# Altium project SMALL_BCMV1.0.PrjPcb (part 2 of 3)

## Sheet Controller.SchDoc
size A2; SheetNumber: 13; SheetTotal: 13
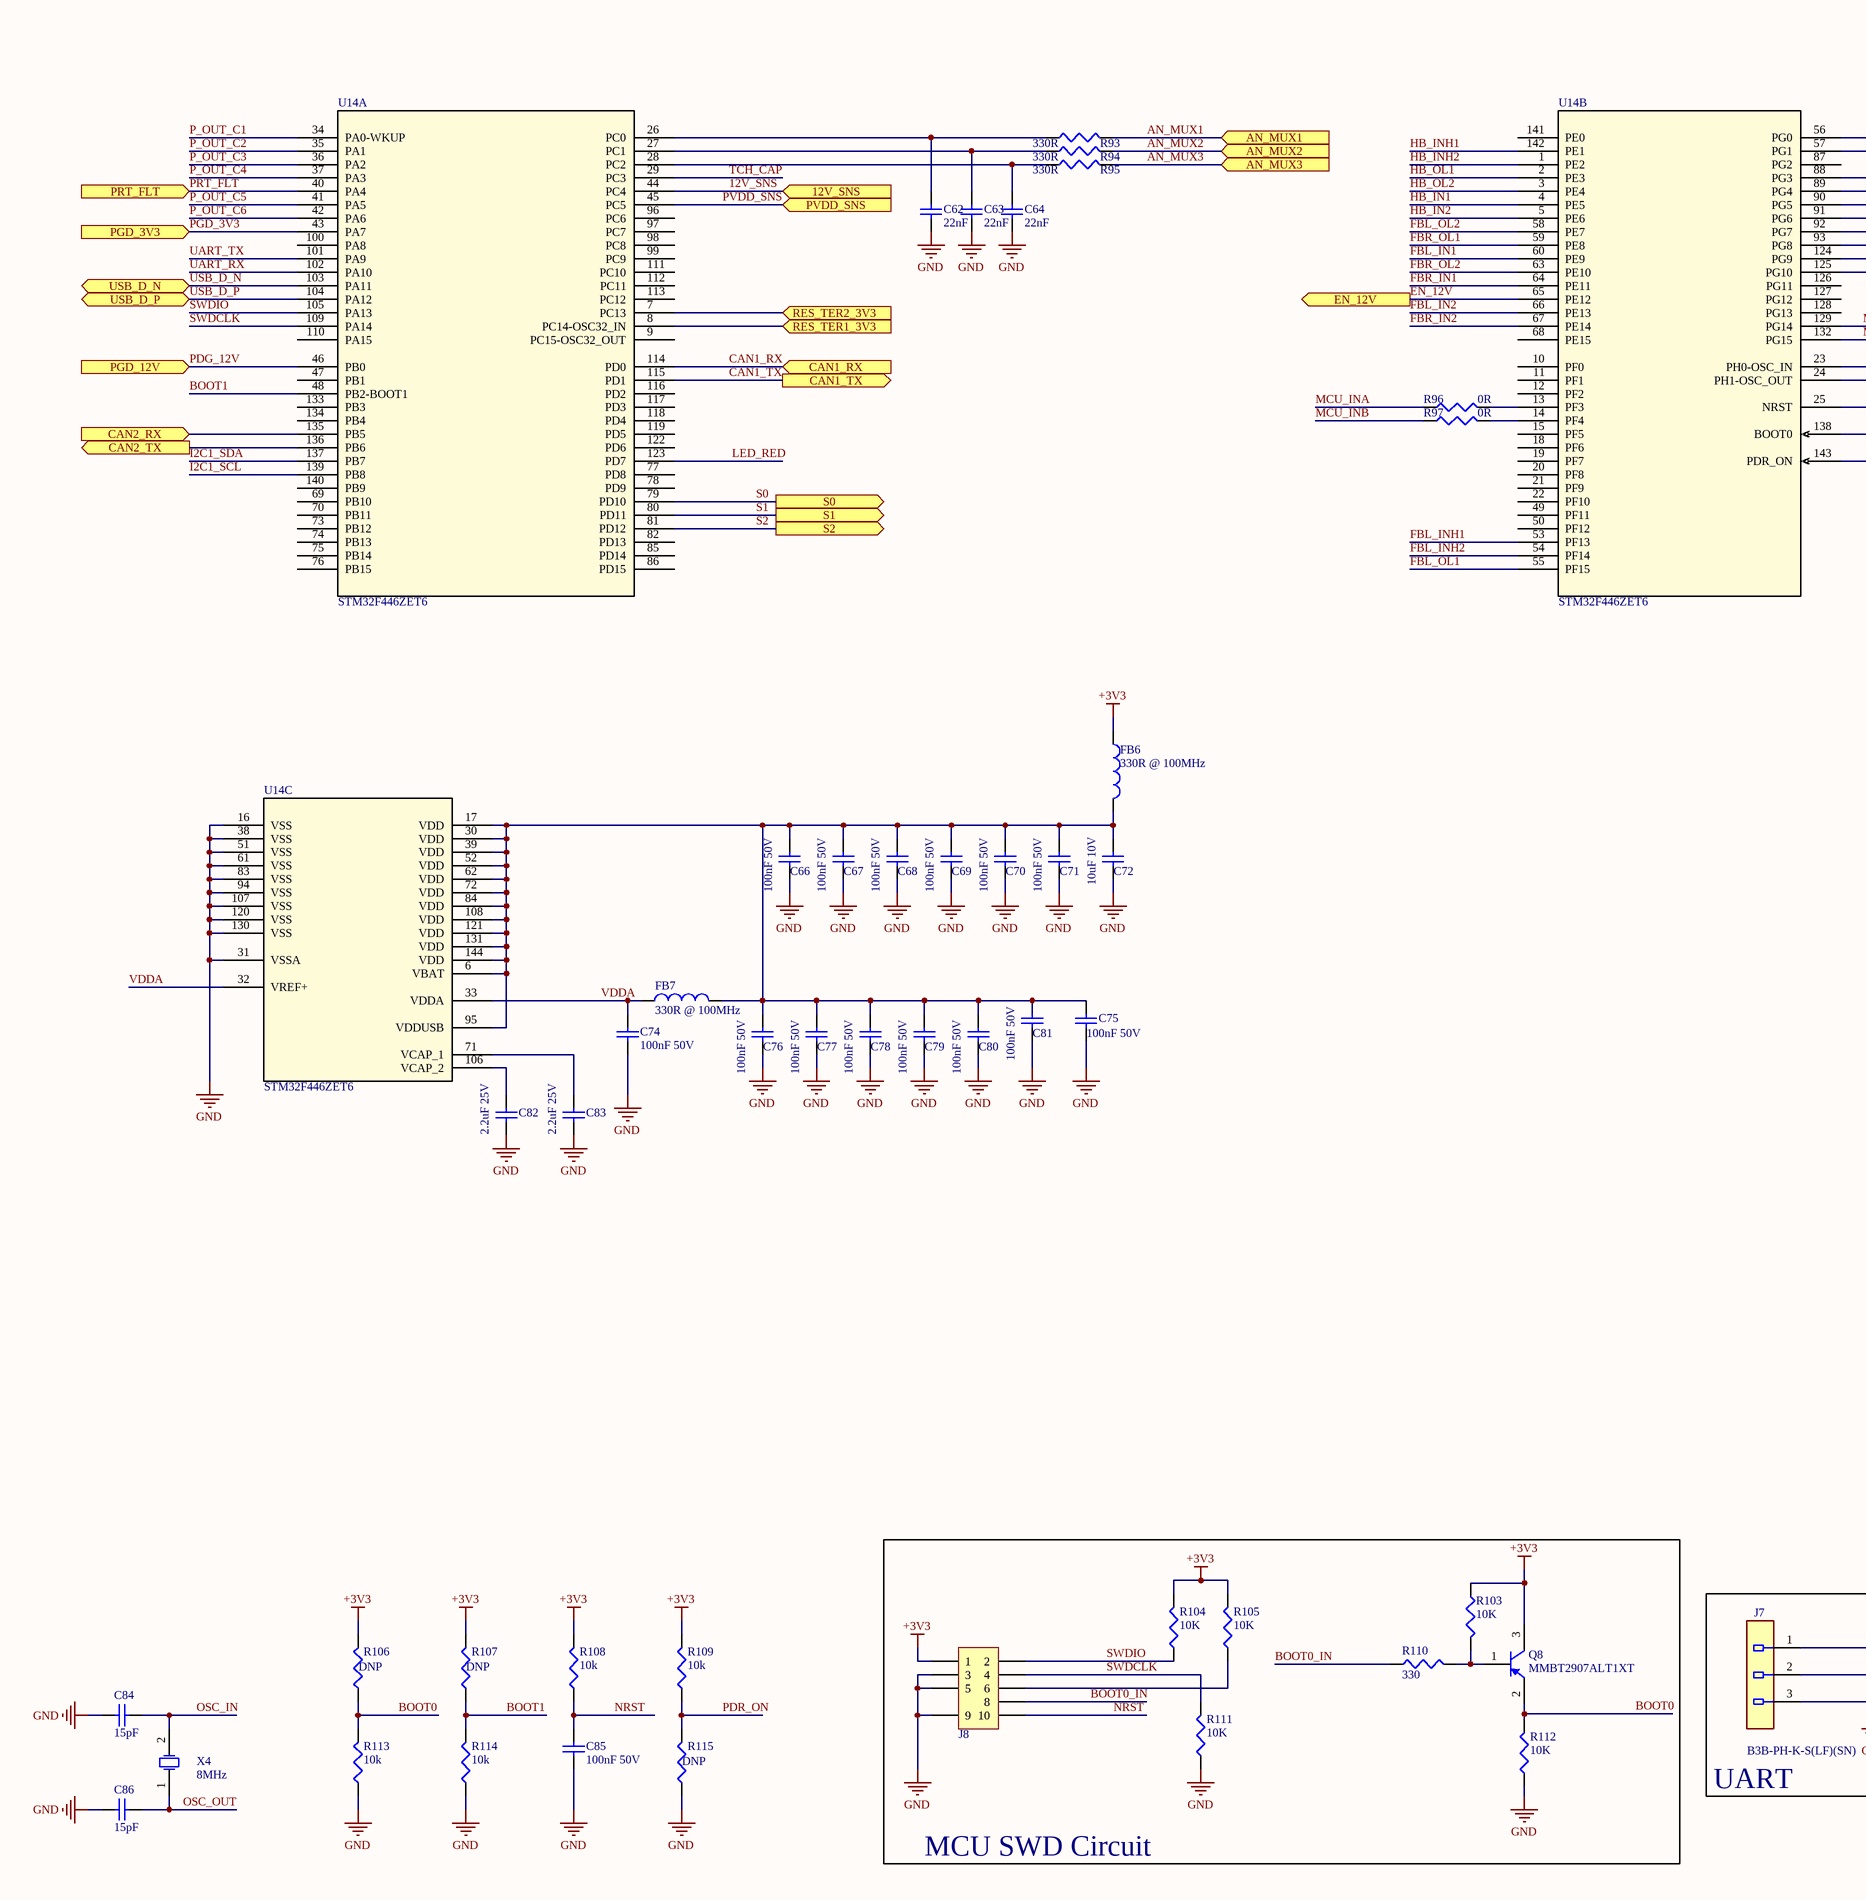
[diagram p12: Controller.SchDoc, left]
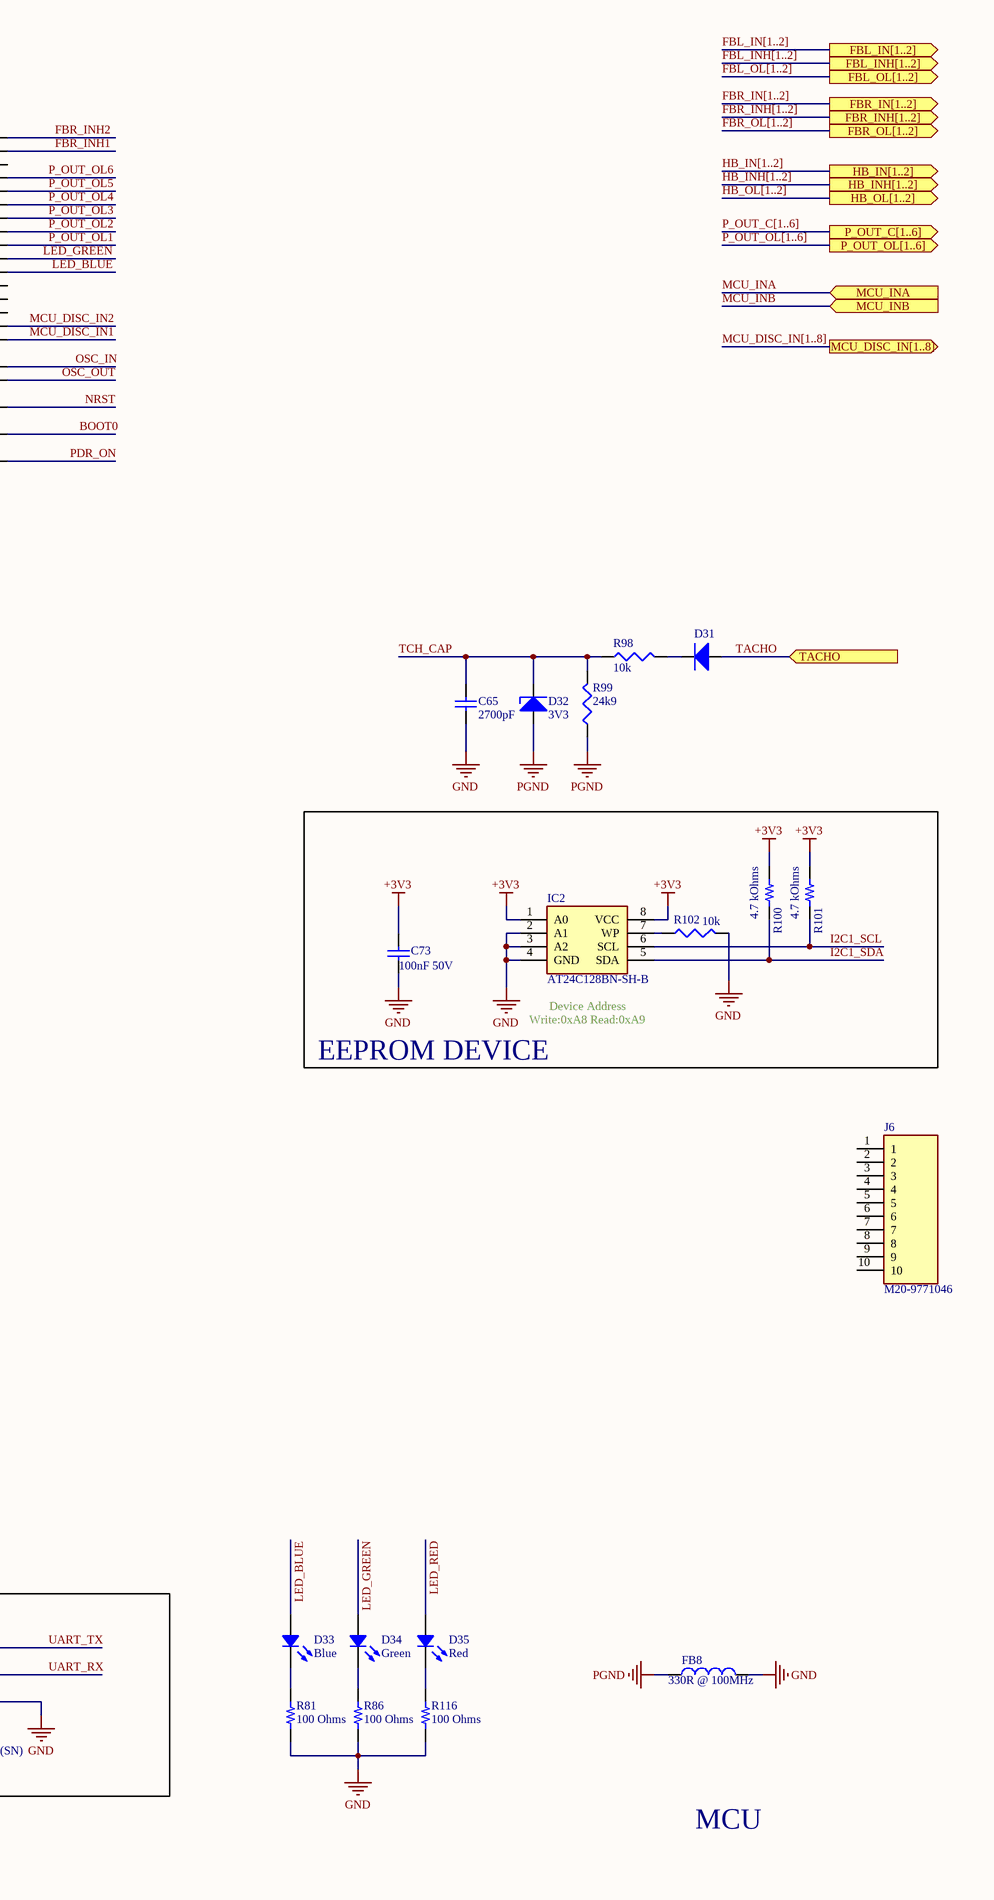
[diagram p13: Controller.SchDoc, right]

### Parts
C62  22nF  [CAP0603]
C63  22nF  [CAP0603]
C64  22nF  [CAP0603]
C65  2700pF  [CAP0603]
C66  100nF 50V  [CAP0603]
C67  100nF 50V  [CAP0603]
C68  100nF 50V  [CAP0603]
C69  100nF 50V  [CAP0603]
C70  100nF 50V  [CAP0603]
C71  100nF 50V  [CAP0603]
C72  10uF 10V  [CAP0805]
C73  100nF 50V  [CAP0603]
C74  100nF 50V  [CAP0603]
C75  100nF 50V  [CAP0603]
C76  100nF 50V  [CAP0603]
C77  100nF 50V  [CAP0603]
C78  100nF 50V  [CAP0603]
C79  100nF 50V  [CAP0603]
C80  100nF 50V  [CAP0603]
C81  100nF 50V  [CAP0603]
C82  2.2uF 25V  [CAP0603]
C83  2.2uF 25V  [CAP0603]
C84  15pF  [CAP0603]
C85  100nF 50V  [CAP0603]
C86  15pF  [CAP0603]
D31  100V 300mA  [SOD123_1N4148W-7-F]  (value not drawn)
D32  3V3  [SOD323]
D33  Blue  [LED 0805_2012 BLUE]
D34  Green  [LED 0805_2012 GREEN]
D35  Red  [LED 0805_2012 RED]
FB6  330R @ 100MHz  [FB0603]
FB7  330R @ 100MHz  [FB0603]
FB8  330R @ 100MHz  [FB0603]
IC2  AT24C128BN-SH-B  [SOIC127P600X175-8N]
J6  M20-9771046  [HDRV10W66P0X254_1X10_2540X254X844P]
J7  B3B-PH-K-S_LF_SN  [JST_B3B-PH-K-S_LF_SN_0]  (value not drawn)
J8  9 pos  [FTSH-105-01-F-DV-007-K-P]  (value not drawn)
Q8  MMBT2907ALT1XT  [SOT95P245X110-3N]
R81  100 Ohms  [RES 0805_2012]
R86  100 Ohms  [RES 0805_2012]
R93  330R  [RES0603]
R94  330R  [RES0603]
R95  330R  [RES0603]
R96  0R  [RES0603]
R97  0R  [RES0603]
R98  10k  [RES0603]
R99  24k9  [RES0603]
R100  4.7 kOhms  [RES 0603_1608]
R101  4.7 kOhms  [RES 0603_1608]
R102  10k  [RES0603]
R103  10K  [R 0603(1608)]
R104  10K  [R 0603(1608)]
R105  10K  [R 0603(1608)]
R106  Assembly: DNP  [RES0603]  (hidden comment: 10k)
R107  Assembly: DNP  [RES0603]  (hidden comment: 10k)
R108  10k  [RES0603]
R109  10k  [RES0603]
R110  330  [R 0603(1608)]
R111  10K  [R 0603(1608)]
R112  10K  [R 0603(1608)]
R113  10k  [RES0603]
R114  10k  [RES0603]
R115  Assembly: DNP  [RES0603]  (hidden comment: 10k)
R116  100 Ohms  [RES 0805_2012]
U14  STM32F446ZET6  [LQFP144-20x20mm]  (parts A,B,C of 3)
X4  8MHz  [CRY_NX8045GB]

### Blocks framed on the sheet
EEPROM DEVICE: C73 IC2 R100-R102
MCU SWD Circuit: J8 Q8 R103-R105 R110-R112
UART: J7

### Ports
12V_SNS (in), AN_MUX1 (in), AN_MUX2 (in), AN_MUX3 (in), CAN1_RX (in), CAN1_TX (out), CAN2_RX (in), CAN2_TX (out), EN_12V (out), FBL_IN[1..2] (out), FBL_INH[1..2] (out), FBL_OL[1..2] (out), FBR_IN[1..2] (out), FBR_INH[1..2] (out), FBR_OL[1..2] (out), HB_IN[1..2] (out), HB_INH[1..2] (out), HB_OL[1..2] (out), MCU_DISC_IN[1..8] (out), MCU_INA (in), MCU_INB (in), P_OUT_C[1..6] (out), P_OUT_OL[1..6] (out), PGD_3V3 (in), PGD_12V (in), PRT_FLT (in), PVDD_SNS (in), RES_TER1_3V3 (in), RES_TER2_3V3 (in), S0 (out), S1 (out), S2 (out), TACHO (in), USB_D_N (bidir), USB_D_P (bidir)

### Nets
+3V3: C73.2 FB6.2 IC2.1(A0) IC2.8(VCC) J8.1 Q8.3(C) R100.2 R101.2 R103.2 R104.1 R105.1 R106.2 R107.2 R108.2 R109.2
GND: C62.2 C63.2 C64.2 C65.1 C66.1 C67.1 C68.1 C69.1 C70.1 C71.1 C72.1 C73.1 C74.1 C75.1 C76.1 C77.1 C78.1 C79.1 C80.1 C81.1 C82.1 C83.1 C84.1 C85.1 C86.1 FB8.2 IC2.2(A1) IC2.3(A2) IC2.4(GND) J7.3 J8.3 J8.5 J8.9 R81.2 R86.2 R102.1 R111.2 R112.1 R113.1 R114.1 R115.1 R116.2 U14.16(VSS) U14.31(VSSA) U14.38(VSS) U14.51(VSS) U14.61(VSS) U14.83(VSS) U14.94(VSS) U14.107(VSS) U14.120(VSS) U14.130(VSS)
PGND: D32.2(A) FB8.1 R99.1
12V_SNS: U14.44(PC4) ; port 12V_SNS
AN_MUX1: R93.2 ; port AN_MUX1
AN_MUX2: R94.2 ; port AN_MUX2
AN_MUX3: R95.2 ; port AN_MUX3
BOOT0: Q8.2(E) R106.1 R112.2 R113.2 U14.138(BOOT0)
BOOT0_IN: J8.8 R110.2
BOOT1: R107.1 R114.2 U14.48(PB2-BOOT1)
CAN1_RX: U14.114(PD0) ; port CAN1_RX
CAN1_TX: U14.115(PD1) ; port CAN1_TX
CAN2_RX: U14.135(PB5) ; port CAN2_RX
CAN2_TX: U14.136(PB6) ; port CAN2_TX
EN_12V: U14.65(PE12) ; port EN_12V
FBL_IN1: U14.60(PE9)
FBL_IN2: U14.66(PE13)
FBL_INH1: U14.53(PF13)
FBL_INH2: U14.54(PF14)
FBL_OL1: U14.55(PF15)
FBL_OL2: U14.58(PE7)
FBR_IN1: U14.64(PE11)
FBR_IN2: U14.67(PE14)
FBR_INH1: U14.57(PG1)
FBR_INH2: U14.56(PG0)
FBR_OL1: U14.59(PE8)
FBR_OL2: U14.63(PE10)
HB_IN1: U14.4(PE5)
HB_IN2: U14.5(PE6)
HB_INH1: U14.142(PE1)
HB_INH2: U14.1(PE2)
HB_OL1: U14.2(PE3)
HB_OL2: U14.3(PE4)
I2C1_SCL: IC2.6(SCL) R101.1 U14.139(PB8)
I2C1_SDA: IC2.5(SDA) R100.1 U14.137(PB7)
LED_BLUE: D33.1 U14.125(PG10)
LED_GREEN: D34.1 U14.124(PG9)
LED_RED: D35.1 U14.123(PD7)
MCU_DISC_IN1: U14.132(PG15)  [project net MCU_D0]
MCU_DISC_IN2: U14.129(PG14)  [project net MCU_D0]
MCU_INA: R96.1 ; port MCU_INA
MCU_INB: R97.1 ; port MCU_INB
NRST: C85.2 J8.10 R108.1 U14.25(NRST)
OSC_IN: C84.2 U14.23(PH0-OSC_IN) X4.2(OSC2)
OSC_OUT: C86.2 U14.24(PH1-OSC_OUT) X4.1(OSC1)
P_OUT_C1: U14.34(PA0-WKUP)
P_OUT_C2: U14.35(PA1)
P_OUT_C3: U14.36(PA2)
P_OUT_C4: U14.37(PA3)
P_OUT_C5: U14.41(PA5)
P_OUT_C6: U14.42(PA6)
P_OUT_OL1: U14.93(PG8)
P_OUT_OL2: U14.92(PG7)
P_OUT_OL3: U14.91(PG6)
P_OUT_OL4: U14.90(PG5)
P_OUT_OL5: U14.89(PG4)
P_OUT_OL6: U14.88(PG3)
PDG_12V: U14.46(PB0) ; port PGD_12V
PDR_ON: R109.1 R115.2 U14.143(PDR_ON)
PGD_3V3: U14.43(PA7) ; port PGD_3V3
PRT_FLT: U14.40(PA4) ; port PRT_FLT
PVDD_SNS: U14.45(PC5) ; port PVDD_SNS
RES_TER1_3V3: U14.8(PC14-OSC32_IN) ; port RES_TER1_3V3
RES_TER2_3V3: U14.7(PC13) ; port RES_TER2_3V3
S0: U14.79(PD10) ; port S0
S1: U14.80(PD11) ; port S1
S2: U14.81(PD12) ; port S2
SWDCLK: J8.4 R111.1 U14.109(PA14)
SWDIO: J8.2 R104.2 U14.105(PA13)
TACHO: D31.1(A) ; port TACHO
TCH_CAP: C65.2 D32.1(K) R98.1 R99.2 U14.29(PC3)
UART_RX: J7.2 U14.102(PA10)
UART_TX: J7.1 U14.101(PA9)
USB_D_N: U14.103(PA11) ; port USB_D_N
USB_D_P: U14.104(PA12) ; port USB_D_P
VDDA: C74.2 FB7.2 U14.32(VREF+) U14.33(VDDA)
NetC62_1: C62.1 R93.1 U14.26(PC0)
NetC63_1: C63.1 R94.1 U14.27(PC1)
NetC64_1: C64.1 R95.1 U14.28(PC2)
NetC66_2: C66.2 C67.2 C68.2 C69.2 C70.2 C71.2 C72.2 C75.2 C76.2 C77.2 C78.2 C79.2 C80.2 C81.2 FB6.1 FB7.1 U14.6(VBAT) U14.17(VDD) U14.30(VDD) U14.39(VDD) U14.52(VDD) U14.62(VDD) U14.72(VDD) U14.84(VDD) U14.95(VDDUSB) U14.108(VDD) U14.121(VDD) U14.131(VDD) U14.144(VDD)
NetC82_2: C82.2 U14.106(VCAP_2)
NetC83_2: C83.2 U14.71(VCAP_1)
NetD31_2: D31.2(K) R98.2
NetD33_2: D33.2 R81.1
NetD34_2: D34.2 R86.1
NetD35_2: D35.2 R116.1
NetIC2_7: IC2.7(WP) R102.2
NetJ8_6: J8.6 R105.2
NetQ8_1: Q8.1(B) R103.1 R110.1
NetR96_2: R96.2 U14.13(PF3)
NetR97_2: R97.2 U14.14(PF4)

Not connected (* = marked no-connect by the designer): J6 1 2 3 4 5 6 7 8 9 10; U14 9(PC15-OSC32_OUT) 10(PF0) 11(PF1) 12(PF2) 15(PF5) 18(PF6) 19(PF7) 20(PF8) 21(PF9) 22(PF10) 47(PB1) 49(PF11) 50(PF12) 68(PE15) 69(PB10) 70(PB11) 73(PB12) 74(PB13) 75(PB14) 76(PB15) 77(PD8) 78(PD9) 82(PD13) 85(PD14) 86(PD15) 87(PG2) 96(PC6) 97(PC7) 98(PC8) 99(PC9) 100(PA8) 110(PA15) 111(PC10) 112(PC11) 113(PC12) 116(PD2) 117(PD3) 118(PD4) 119(PD5) 122(PD6) 126(PG11) 127(PG12) 128(PG13) 133(PB3) 134(PB4) 140(PB9) 141(PE0)

### Buses and harness runs
bus FBL_IN[1..2] = port FBL_IN[1..2]
bus FBL_INH[1..2] = port FBL_INH[1..2]
bus FBL_OL[1..2] = port FBL_OL[1..2]
bus FBR_IN[1..2] = port FBR_IN[1..2]
bus FBR_INH[1..2] = port FBR_INH[1..2]
bus FBR_OL[1..2] = port FBR_OL[1..2]
bus HB_IN[1..2] = port HB_IN[1..2]
bus HB_INH[1..2] = port HB_INH[1..2]
bus HB_OL[1..2] = port HB_OL[1..2]
bus MCU_DISC_IN[1..8] = port MCU_DISC_IN[1..8]
bus P_OUT_C[1..6] = port P_OUT_C[1..6]
bus P_OUT_OL[1..6] = port P_OUT_OL[1..6]

### Notes on the sheet
- Write:0xA8 Read:0xA9
- (near IC2) Device Address
- MCU

### Library data of the parts
C62-C64 = CAP0603_22nF: CAP CER 0.022UF 50V X7R 0603; P/N: CL10B223JB8NNNC; Value: 22nF 50V; Order Code: DIGI : 1276-1996-1-ND
C65 = CAP0603_2700pF: CAP CER 1200PF 50V X7R 0603; P/N: CL10B272KB8NNNC; Value: 2700pF 50V; Order Code: DIGI : 1276-2022-1-ND
C66-C71 C73-C81 C85 = CAP0603_100nF: CAP CER 0.1UF 50V X7R 0603; P/N: C0603C104K5RACTU; Order Code: DIGI : 399-5089-1-ND; Value: 100nF 50V
C72 = CAP0805_10uF: CAP CER 10UF 10V X7R 0805; P/N: GRM21BR71A106MA73L; Order Code: DIGI : 490-10517-1-ND; Value: 10uF 10V
C82 C83 = CAP0603_2.2uF: CAP CER 2.2UF 25V X7S 0603; P/N: GRM188C71E225KE11D; Order Code: DIGI : 490-12732-1-ND; Value: 2.2uF 25V
C84 C86 = CAP0603_15pF: CAP CER 15PF 50V C0G/NP0 0603; P/N: 06035A150JAT4A; Order Code: DIGI : 478-10677-1-ND; Value: 15pF 50V
D31 = DIODE_1N4148W-7-F: DIODE GEN PURP 100V 300MA SOD123; Order Code: DIGI : 1N4148W-FDICT-ND; P/N: 1N4148W-7-F; Value: 100V 300mA
D32 = ZENER_3V3_MM3Z3V3T1G: DIODE ZENER 3.3V 300MW SOD323; Order Code: DIGI : MM3Z3V3T1GOSCT-ND; P/N: MM3Z3V3T1G; Value: 3V3
D33 = IN-S85AT5B: LED BLUE CLEAR 0805 SMD; Manufacturer: Inolux; Configuration: Standard; Current - Test: 5mA; Lens Size: 1.40mm x 1.25mm; Lens Style: Rectangle with Flat Top; Millicandela Rating: 80mcd; Viewing Angle: 120°; Voltage - Forward (Vf) (Typ): 3V; Wavelength - Dominant: 470nm; Wavelength - Peak: 473nm; Part Number: IN-S85AT5B; Color: Blue; ComponentLink1Description: Datasheet; ComponentLink1URL: http://www.inolux-corp.com/datasheet/SMDLED/Mono%20Color%20Top%20View/IN-S85AT%20Series_V1.1.pdf; ComponentLink2Description: DigiKey Link; ComponentLink2URL: https://www.digikey.com/en/products/detail/inolux/IN-S85AT5B/7604912; Device Package: 0805 (2012 Metric); Height (Max): 1.10mm; LastUpdated: 30.06.2022 22:50:57; Lens Color: Clear; Lens Transparency: Clear; Lifecycle Status: Active; Minimum Order: 1; Mounting Type: Surface Mount; Package / Case: 0805 (2012 Metric); Packaging: TapeAndReel; PartId: 751; Part Status: Active; Price: 0.04; Series: IN-S85AT; Size / Dimension: 2.00mm L x 1.25mm W; Supplier 1: DigiKey; Supplier Part Number 1: 1830-1078-1-ND; Supplier Device Package: 0805; Value: Blue
D34 = QTLP630C4TR: LED GREEN CLEAR 0805 SMD; Manufacturer: Everlight Electronics Co Ltd; Configuration: Standard; Current - Test: 20mA; Lens Color: Colorless; Lens Size: 1.40mm x 1.25mm; Lens Style: Rectangle with Flat Top; Millicandela Rating: 10mcd; Viewing Angle: 140°; Voltage - Forward (Vf) (Typ): 2.1V; Wavelength - Dominant: 570nm; Wavelength - Peak: 565nm; Part Number: QTLP630C4TR; Color: Green; ComponentLink1Description: Datasheet; ComponentLink1URL: //media.digikey.com/PDF/Data%20Sheets/Everlight%20PDFs/QTLP630-2.pdf; ComponentLink2Description: DigiKey Link; ComponentLink2URL: https://www.digikey.com/en/products/detail/everlight-electronics-co-ltd/QTLP630C4TR/2675902; Device Package: 0805 (2012 Metric); Height (Max): 1.20mm; LastUpdated: 30.06.2022 22:51:35; Lens Transparency: Clear; Lifecycle Status: Active; Minimum Order: 1; Mounting Type: Surface Mount; Package / Case: 0805 (2012 Metric); Packaging: TapeAndReel; PartId: 240; Part Status: Active; Price: 0.04; Series: -; Size / Dimension: 2.00mm L x 1.25mm W; Supplier 1: DigiKey; Supplier Part Number 1: 1080-1411-1-ND; Supplier Device Package: 0805; Value: Green
D35 = APT2012EC: LED RED CLEAR CHIP SMD; Manufacturer: Kingbright; Configuration: Standard; Current - Test: 20mA; Lens Color: Colorless; Lens Size: 1.30mm x 1.25mm; Lens Style: Rectangle with Flat Top; Millicandela Rating: 8mcd; Viewing Angle: 120°; Voltage - Forward (Vf) (Typ): 2V; Wavelength - Dominant: 617nm; Wavelength - Peak: 627nm; Part Number: APT2012EC; Color: Red; ComponentLink1Description: Datasheet; ComponentLink1URL: http://www.kingbrightusa.com/images/catalog/SPEC/APT2012EC.pdf; ComponentLink2Description: DigiKey Link; ComponentLink2URL: https://www.digikey.com/en/products/detail/kingbright/APT2012EC/1747527; Device Package: 0805 (2012 Metric); Height (Max): 0.75mm; LastUpdated: 30.06.2022 22:51:30; Lens Transparency: Clear; Lifecycle Status: Active; Minimum Order: 1; Mounting Type: Surface Mount; Package / Case: 0805 (2012 Metric); Packaging: TapeAndReel; PartId: 306; Part Status: Active; Price: 0.05; Series: -; Size / Dimension: 2.00mm L x 1.25mm W; Supplier 1: DigiKey; Supplier Part Number 1: 754-1128-1-ND; Supplier Device Package: Chip LED; Value: Red
FB6-FB8 = FB0603_330R@100MHz: FERRITE BEAD 330 OHM 0603 1LN; P/N: BLM18SG331TN1D; Order Code: DIGI : 490-3997-1-ND; Value: 330R @ 100MHz
IC2 = AT24C128BN-SH-B: Integrated Circuit; Manufacturer_Name: Microchip; Datasheet Link: https://componentsearchengine.com/Datasheets/1/AT24C128BN-SH-B.pdf; Height: 1.75mm; Manufacturer_Part_Number: AT24C128BN-SH-B; Mouser Part Number: 556-A24C128BNSH-B; Mouser Price/Stock: https://www.mouser.co.uk/ProductDetail/Microchip-Technology-Atmel/AT24C128BN-SH-B?qs=j6lVIf5KywAfpl9r4qbAuQ%3D%3D
J6 = M20-9771046: Connector; Manufacturer_Name: Harwin; Datasheet Link: https://cdn.harwin.com/pdfs/M20-977.pdf; Height: 8.44mm; Manufacturer_Part_Number: M20-9771046; Mouser Part Number: 855-M20-9771046; Mouser Price/Stock: https://www.mouser.co.uk/ProductDetail/Harwin/M20-9771046?qs=%252Bk6%2F5FB6qrkye1Jo80kn3Q%3D%3D
J7 = B3B-PH-K-S_LF_SN: Manufacturer Part Number: B3B-PH-K-S(LF)(SN); Order Code: DIGI : 455-1705-ND; Part Number: B3B-PH-K-S(LF)(SN)
J8 = FTSH-105-01-F-DV-007-K-P: CONN HEADER 9 POS DUAL .05" SMD; Order Code: DIGI : SAM11250-ND; P/N: FTSH-105-01-F-DV-007-K-P; Value: 9 pos
Q8 = MMBT2907ALT1XT: Bipolar Transistors - BJT AF TRANS GP BJT PNP 60V 0.6A; Manufacturer Product Number: MMBT2907ALT1XT
R81 R86 R116 = RK73B2ATTD101J: RES 100 OHM 5% 1/4W 0805; Manufacturer: KOA Speer Electronics, Inc.; Power (Watts): 0.25W, 1/4W; Temperature Coefficient: ±200ppm/°C; Part Number: RK73B2ATTD101J; Value: 100 Ohms; ComponentLink1Description: Datasheet; ComponentLink1URL: http://www.koaspeer.com/catimages/Products/RK73B/RK73B.pdf; ComponentLink2Description: DigiKey Link; ComponentLink2URL: https://www.digikey.com/en/products/detail/koa-speer-electronics-inc/RK73B2ATTD101J/10236510; Composition: Thick Film; Device Package: 0805 (2012 Metric); Features: Automotive AEC-Q200; Height - Seated (Max): 0.024" (0.60mm); LastUpdated: 30.06.2022 22:38:44; Lifecycle Status: Active; Minimum Order: 1; Number of Terminations: 2; Operating Temperature: -55°C ~ 155°C; Package / Case: 0805 (2012 Metric); Packaging: CutTape; PartId: 39368; Part Status: Active; Price: 0.01; Ratings: AEC-Q200; Resistance: 100 Ohms; Series: RK73B; Size / Dimension: 0.079" L x 0.049" W (2.00mm x 1.25mm); Supplier 1: DigiKey; Supplier Part Number 1: 2019-RK73B2ATTD101JCT-ND; Supplier Device Package: 0805; Tolerance: ±5%
R93-R95 = RES0603_330R: RES 330 OHM 1% 1/10W 0603; Order Code: DIGI : RMCF0603FT330RCT-ND; P/N: RMCF0603FT330R; ART Code: ART0021648; Value: 330R
R96 R97 = RES0603_0R: RES SMD 0 OHM JUMPER 1/10W 0603; Order Code: DIGI : P0.0GCT-ND; P/N: ERJ-3GEY0R00V; ART Code: ART0016157; Value: 0R
R98 R102 = RES0603_10k: RES SMD 10K OHM 5% 1/10W 0603; Order Code: DIGI : 311-10KGRCT-ND; P/N: RC0603JR-0710KL; ART Code: ART0020747; Value: 10k
R99 = RES0603_24k9: RES SMD 24.9K OHM 1% 1/10W 0603; Order Code: DIGI : P24.9KHCT-ND; P/N: ERJ-3EKF2492V; Value: 24k9
R100 R101 = RK73B1JTTD472J: RES 4.7K OHM 5% 1/10W 0603; Manufacturer: KOA Speer Electronics, Inc.; Power (Watts): 0.1W, 1/10W; Temperature Coefficient: ±200ppm/°C; Part Number: RK73B1JTTD472J; Value: 4.7 kOhms; ComponentLink1Description: Datasheet; ComponentLink1URL: http://www.koaspeer.com/catimages/Products/RK73B/RK73B.pdf; ComponentLink2Description: DigiKey Link; ComponentLink2URL: https://www.digikey.com/en/products/detail/koa-speer-electronics-inc/RK73B1JTTD472J/9844699; Composition: Thick Film; Device Package: 0603 (1608 Metric); Features: Automotive AEC-Q200; Height - Seated (Max): 0.022" (0.55mm); LastUpdated: 18.06.2022 06:14:08; Lifecycle Status: Active; Minimum Order: 0; Number of Terminations: 2; Operating Temperature: -55°C ~ 155°C; Package / Case: 0603 (1608 Metric); PartId: 5830; Part Status: Active; Price: 0; Ratings: AEC-Q200; Resistance: 4.7 kOhms; Series: RK73B; Size / Dimension: 0.063" L x 0.031" W (1.60mm x 0.80mm); Supplier 1: DigiKey; Supplier Part Number 1: 2019-RK73B1JTTD472JTR-ND; Supplier Device Package: 0603; Tolerance: ±5%
R103-R105 R111 R112 = Res3: Res General Purpose Thick Film 0603 10K Ohm 1% 1/10W ±100ppm/°C Molded SMD Paper T/R; Manufacturer: Yageo; Manufacturer Part Number: RC0603FR-0710KL; Resistance: 10kR; Voltage Rating (DC): 50V; Power Rating: 100mW; Voltage Rating: 75V; ComponentLink1URL: https://datasheet.ciiva.com/11819/0900766b80c66297-11819477.pdf?src-supplier=RSComponents; ComponentLink1Description: https://datasheet.ciiva.com/11819/0900766b80c66297-11819477.pdf?src-supplier=RSComponents; ComponentLink2URL: https://datasheet.ciiva.com/12666/pyu-rc0402-51-rohs-l-6-r-12666741.pdf?src-supplier=Mouser; ComponentLink2Description: https://datasheet.ciiva.com/12666/pyu-rc0402-51-rohs-l-6-r-12666741.pdf?src-supplier=Mouser; ComponentLink3URL: https://datasheet.ciiva.com/17063/pyu-rc0402-51-rohs-l-6-r-17063193.pdf?src-supplier=Future+Electronics; ComponentLink3Description: https://datasheet.ciiva.com/17063/pyu-rc0402-51-rohs-l-6-r-17063193.pdf?src-supplier=Future+Electronics; ComponentLink4URL: https://datasheet.ciiva.com/22747/1018594-22747513.pdf?src-supplier=Element14; ComponentLink4Description: https://datasheet.ciiva.com/22747/1018594-22747513.pdf?src-supplier=Element14; ComponentLink5URL: https://datasheet.ciiva.com/7849/1018594-7849869.pdf?src-supplier=Element14; ComponentLink5Description: https://datasheet.ciiva.com/7849/1018594-7849869.pdf?src-supplier=Element14; ComponentLink6URL: https://datasheet.ciiva.com/7983/1018594-7983502.pdf?src-supplier=Element14; ComponentLink6Description: https://datasheet.ciiva.com/7983/1018594-7983502.pdf?src-supplier=Element14; ComponentLink7URL: https://datasheet.ciiva.com/7849/1018594-7849871.pdf?src-supplier=Element14; ComponentLink7Description: https://datasheet.ciiva.com/7849/1018594-7849871.pdf?src-supplier=Element14; ComponentLink8URL: https://datasheet.ciiva.com/11808/0900766b80c66297-11808195.pdf?src-supplier=RSComponents; ComponentLink8Description: https://datasheet.ciiva.com/11808/0900766b80c66297-11808195.pdf?src-supplier=RSComponents; ComponentLink9URL: https://datasheet.ciiva.com/2452/pyu-rc0402-51-rohs-l-6-2452608.pdf?src-supplier=Digi-Key; ComponentLink9Description: https://datasheet.ciiva.com/2452/pyu-rc0402-51-rohs-l-6-2452608.pdf?src-supplier=Digi-Key; ComponentLink10URL: https://datasheet.ciiva.com/2452/pyu-r-int-thick-7-2452609.pdf?src-supplier=Digi-Key; ComponentLink10Description: https://datasheet.ciiva.com/2452/pyu-r-int-thick-7-2452609.pdf?src-supplier=Digi-Key; ComponentLink11URL: https://datasheet.ciiva.com/2452/pyu-r-int-thick-7-2452610.pdf?src-supplier=Digi-Key; ComponentLink11Description: https://datasheet.ciiva.com/2452/pyu-r-int-thick-7-2452610.pdf?src-supplier=Digi-Key; ComponentLink12URL: https://datasheet.ciiva.com/28386/pyu-rc0402-51-rohs-l-6-28386633.pdf?src-supplier=Avnet+Europe; ComponentLink12Description: https://datasheet.ciiva.com/28386/pyu-rc0402-51-rohs-l-6-28386633.pdf?src-supplier=Avnet+Europe; ComponentLink13URL: https://datasheet.ciiva.com/22747/1018594-22747515.pdf?src-supplier=Element14; ComponentLink13Description: https://datasheet.ciiva.com/22747/1018594-22747515.pdf?src-supplier=Element14; ComponentLink14URL: https://datasheet.ciiva.com/7983/1018594-7983535.pdf?src-supplier=Element14; ComponentLink14Description: https://datasheet.ciiva.com/7983/1018594-7983535.pdf?src-supplier=Element14; ComponentLink15URL: https://datasheet.ciiva.com/8896/pyu-rc0402-51-rohs-l-6-8896201.pdf?src-supplier=Avnet; ComponentLink15Description: https://datasheet.ciiva.com/8896/pyu-rc0402-51-rohs-l-6-8896201.pdf?src-supplier=Avnet; ComponentLink16URL: https://datasheet.ciiva.com/15189/getdatasheetpartid-326379-15189533.pdf?src-supplier=Verical; ComponentLink16Description: https://datasheet.ciiva.com/15189/getdatasheetpartid-326379-15189533.pdf?src-supplier=Verical; Supplier 1: Digi-Key; Supplier Part Number 1: 311-10.0KHRCT-ND; RoHS: Yes; Category: Chip SMD Resistors; Pricing 1: 1=0,10000, 10=0,02400, 100=0,00970, 1000=0,00436, 2500=0,00378 (USD); Case/Package: 0603; Number of Pins: 2; Case Code (Imperial): 0603; Case Code (Metric): 1608; Size Code: 0603; Weight: 7.1E-05oz; Min Operating Temperature: -55°C; Max Operating Temperature: 155°C; Packaging: Tape and Reel; Tolerance: 1%; Resistor Type: Thick Film; Temperature Coefficient: 100ppm/°C; Termination: SMD/SMT; Features: Moisture Resistant; Series: RC; Max Power Dissipation: 100mW; Number of Terminations: 2; Resistance Tolerance: 1%; Construction: Rectangular; Length: 1.6mm; Width: 0.8mm; Height: 0.45mm; Depth: 0.8mm; Lead Pitch: 0.3mm; REACH SVHC: Unknown; Lead Free: Lead Free; Military Standard: Not; RoHS Compliant: Yes
  R103 R112: Stock 1: 31088675
  R104 R105 R111: Stock 1: 16075853; ComponentLink17URL: https://datasheet.ciiva.com/7660/38590-7660789.pdf?src-supplier=Element14; ComponentLink17Description: https://datasheet.ciiva.com/7660/38590-7660789.pdf?src-supplier=Element14; ComponentLink18URL: https://datasheet.ciiva.com/7983/443971-7983596.pdf?src-supplier=Element14; ComponentLink18Description: https://datasheet.ciiva.com/7983/443971-7983596.pdf?src-supplier=Element14; ComponentLink19URL: https://datasheet.ciiva.com/22747/443971-22747519.pdf?src-supplier=Element14; ComponentLink19Description: https://datasheet.ciiva.com/22747/443971-22747519.pdf?src-supplier=Element14; ComponentLink20URL: https://datasheet.ciiva.com/46440/1868787-46440891.pdf?src-supplier=Element14; ComponentLink20Description: https://datasheet.ciiva.com/46440/1868787-46440891.pdf?src-supplier=Element14; ComponentLink21URL: https://datasheet.ciiva.com/7746/1738695-7746239.pdf?src-supplier=Element14; ComponentLink21Description: https://datasheet.ciiva.com/7746/1738695-7746239.pdf?src-supplier=Element14; ComponentLink22URL: https://datasheet.ciiva.com/15189/getdatasheetpartid-409289-15189591.pdf?src-supplier=Verical; ComponentLink22Description: https://datasheet.ciiva.com/15189/getdatasheetpartid-409289-15189591.pdf?src-supplier=Verical
R106-R109 R113-R115 = RES0603_10k: RES SMD 10K OHM 5% 1/10W 0603; Order Code: DIGI : 311-10KGRCT-ND; P/N: RC0603JR-0710KL; Value: 10k
R110 = Res3: YAGEO (PHYCOMP) - RC0603FR-07330RL - RES, THICK FILM, 330R, 1%, 0.1W, 0603; Temperature Coefficient: 100ppm/°C; Voltage Rating (DC): 50V; Power Rating: 100mW; ComponentLink1URL: https://datasheet.ciiva.com/11819/0900766b80c66297-11819477.pdf?src-supplier=RSComponents; ComponentLink1Description: https://datasheet.ciiva.com/11819/0900766b80c66297-11819477.pdf?src-supplier=RSComponents; ComponentLink2URL: https://datasheet.ciiva.com/12666/pyu-rc0402-51-rohs-l-6-r-12666741.pdf?src-supplier=Mouser; ComponentLink2Description: https://datasheet.ciiva.com/12666/pyu-rc0402-51-rohs-l-6-r-12666741.pdf?src-supplier=Mouser; ComponentLink3URL: https://datasheet.ciiva.com/17063/pyu-rc0402-51-rohs-l-6-r-17063193.pdf?src-supplier=Future+Electronics; ComponentLink3Description: https://datasheet.ciiva.com/17063/pyu-rc0402-51-rohs-l-6-r-17063193.pdf?src-supplier=Future+Electronics; ComponentLink4URL: https://datasheet.ciiva.com/22747/1018594-22747513.pdf?src-supplier=Element14; ComponentLink4Description: https://datasheet.ciiva.com/22747/1018594-22747513.pdf?src-supplier=Element14; ComponentLink5URL: https://datasheet.ciiva.com/7849/1018594-7849869.pdf?src-supplier=Element14; ComponentLink5Description: https://datasheet.ciiva.com/7849/1018594-7849869.pdf?src-supplier=Element14; ComponentLink6URL: https://datasheet.ciiva.com/7983/1018594-7983502.pdf?src-supplier=Element14; ComponentLink6Description: https://datasheet.ciiva.com/7983/1018594-7983502.pdf?src-supplier=Element14; ComponentLink7URL: https://datasheet.ciiva.com/7849/1018594-7849871.pdf?src-supplier=Element14; ComponentLink7Description: https://datasheet.ciiva.com/7849/1018594-7849871.pdf?src-supplier=Element14; ComponentLink8URL: https://datasheet.ciiva.com/11808/0900766b80c66297-11808195.pdf?src-supplier=RSComponents; ComponentLink8Description: https://datasheet.ciiva.com/11808/0900766b80c66297-11808195.pdf?src-supplier=RSComponents; ComponentLink9URL: https://datasheet.ciiva.com/2452/pyu-rc0402-51-rohs-l-6-2452608.pdf?src-supplier=Digi-Key; ComponentLink9Description: https://datasheet.ciiva.com/2452/pyu-rc0402-51-rohs-l-6-2452608.pdf?src-supplier=Digi-Key; ComponentLink10URL: https://datasheet.ciiva.com/2452/pyu-r-int-thick-7-2452609.pdf?src-supplier=Digi-Key; ComponentLink10Description: https://datasheet.ciiva.com/2452/pyu-r-int-thick-7-2452609.pdf?src-supplier=Digi-Key; ComponentLink11URL: https://datasheet.ciiva.com/2452/pyu-r-int-thick-7-2452610.pdf?src-supplier=Digi-Key; ComponentLink11Description: https://datasheet.ciiva.com/2452/pyu-r-int-thick-7-2452610.pdf?src-supplier=Digi-Key; ComponentLink12URL: https://datasheet.ciiva.com/28386/pyu-rc0402-51-rohs-l-6-28386633.pdf?src-supplier=Avnet+Europe; ComponentLink12Description: https://datasheet.ciiva.com/28386/pyu-rc0402-51-rohs-l-6-28386633.pdf?src-supplier=Avnet+Europe; ComponentLink13URL: https://datasheet.ciiva.com/22747/1018594-22747515.pdf?src-supplier=Element14; ComponentLink13Description: https://datasheet.ciiva.com/22747/1018594-22747515.pdf?src-supplier=Element14; ComponentLink14URL: https://datasheet.ciiva.com/7983/1018594-7983535.pdf?src-supplier=Element14; ComponentLink14Description: https://datasheet.ciiva.com/7983/1018594-7983535.pdf?src-supplier=Element14; ComponentLink15URL: https://datasheet.ciiva.com/8896/pyu-rc0402-51-rohs-l-6-8896201.pdf?src-supplier=Avnet; ComponentLink15Description: https://datasheet.ciiva.com/8896/pyu-rc0402-51-rohs-l-6-8896201.pdf?src-supplier=Avnet; ComponentLink16URL: https://datasheet.ciiva.com/15189/getdatasheetpartid-326379-15189533.pdf?src-supplier=Verical; ComponentLink16Description: https://datasheet.ciiva.com/15189/getdatasheetpartid-326379-15189533.pdf?src-supplier=Verical; Supplier 1: Digi-Key; Supplier Part Number 1: 311-330HRCT-ND; Manufacturer: Yageo; Manufacturer Part Number: RC0603FR-07330RL; RoHS: Yes; Category: Chip SMD Resistors; Stock 1: 1770208; Pricing 1: 1=0,10000, 10=0,02400, 100=0,00970, 1000=0,00436, 2500=0,00378 (USD); Case/Package: 0603; Number of Pins: 2; Case Code (Metric): 1608; Case Code (Imperial): 0603; Size Code: 0603; Min Operating Temperature: -55°C; Max Operating Temperature: 155°C; Resistance: 330R; Tolerance: 1%; Resistor Type: Thick Film; Packaging: Tape and Reel; Voltage Rating: 50V; Package Quantity: 1; Number of Terminations: 2; Termination: SMD/SMT; Max Power Dissipation: 100mW; Features: Moisture Resistant; Series: RC; Resistance Tolerance: 1%; Technology: THICK FILM; Length: 1.6mm; Width: 0.8mm; Height: 0.45mm; Depth: 0.8mm; REACH SVHC: No SVHC; Lead Free: Lead Free; RoHS Compliant: Yes; ComponentLink17URL: https://datasheet.ciiva.com/11819/0900766b80f96399-11819327.pdf?src-supplier=RSComponents; ComponentLink17Description: https://datasheet.ciiva.com/11819/0900766b80f96399-11819327.pdf?src-supplier=RSComponents; ComponentLink18URL: https://datasheet.ciiva.com/2454/pyu-r-int-thick-7-2454864.pdf?src-supplier=Digi-Key; ComponentLink18Description: https://datasheet.ciiva.com/2454/pyu-r-int-thick-7-2454864.pdf?src-supplier=Digi-Key; ComponentLink19URL: https://datasheet.ciiva.com/2454/pyu-r-int-thick-7-2454865.pdf?src-supplier=Digi-Key; ComponentLink19Description: https://datasheet.ciiva.com/2454/pyu-r-int-thick-7-2454865.pdf?src-supplier=Digi-Key; ComponentLink20URL: https://datasheet.ciiva.com/2454/pyu-r-int-thick-7-2454866.pdf?src-supplier=Digi-Key; ComponentLink20Description: https://datasheet.ciiva.com/2454/pyu-r-int-thick-7-2454866.pdf?src-supplier=Digi-Key; ComponentLink21URL: https://datasheet.ciiva.com/12555/rc0603-272842-12555334.pdf?src-supplier=Mouser; ComponentLink21Description: https://datasheet.ciiva.com/12555/rc0603-272842-12555334.pdf?src-supplier=Mouser; ComponentLink22URL: https://datasheet.ciiva.com/46440/1868787-46440904.pdf?src-supplier=Element14; ComponentLink22Description: https://datasheet.ciiva.com/46440/1868787-46440904.pdf?src-supplier=Element14; ComponentLink23URL: https://datasheet.ciiva.com/7746/443971-7746329.pdf?src-supplier=Element14; ComponentLink23Description: https://datasheet.ciiva.com/7746/443971-7746329.pdf?src-supplier=Element14; ComponentLink24URL: https://datasheet.ciiva.com/7746/443971-7746330.pdf?src-supplier=Element14; ComponentLink24Description: https://datasheet.ciiva.com/7746/443971-7746330.pdf?src-supplier=Element14; ComponentLink25URL: https://datasheet.ciiva.com/7746/1686128-7746331.pdf?src-supplier=Element14; ComponentLink25Description: https://datasheet.ciiva.com/7746/1686128-7746331.pdf?src-supplier=Element14
U14 = STM32F446ZET6: No Description Available; Mfr_Name: STMicroelectronics; Copyright: Copyright (C) 2022 Ultra Librarian. All rights reserved.; Manufacturer_Part_Number: STM32F446ZET6; Digi-Key_Part_Number_1: 497-15374-ND; RefDes: RefDes; Type: DEV
X4 = CRY_NX8045GB-8.000M-STD-CSJ-1: CRYSTAL 8.0000MHZ 8PF SMD; Order Code: DIGI : 644-1206-1-ND; P/N: NX8045GB-8.000M-STD-CSJ-1; Value: 8MHz

## Sheet DISCRETE_INPUT.SchDoc
size A4; SheetNumber: 11; SheetTotal: 13
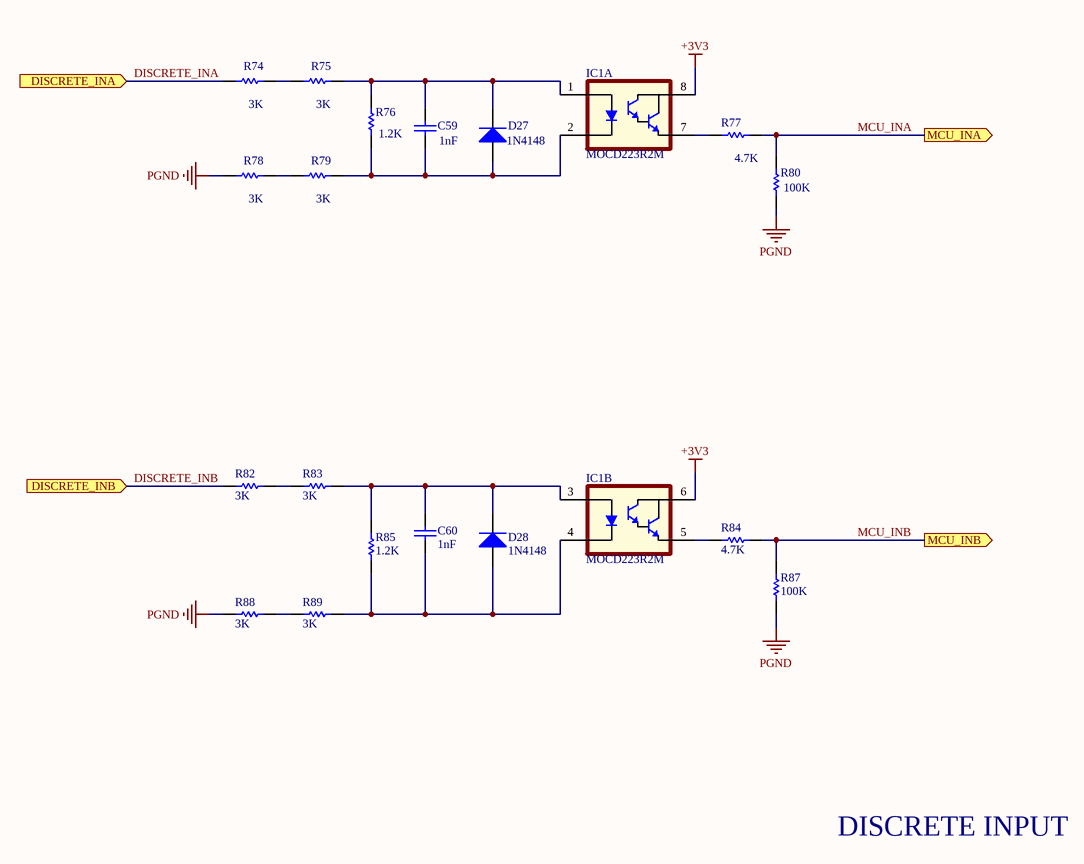
[diagram p14: DISCRETE_INPUT.SchDoc]

### Parts
C59  1nF  [C 0603(1608)x0.8_3]
C60  1nF  [C 0603(1608)x0.8_3]
D27  value 1N4148  [SOD123]  (hidden comment: DIODE 1N4148 GEN PURP 100V 150MA SOD123)
D28  value 1N4148  [SOD123]  (hidden comment: DIODE 1N4148 GEN PURP 100V 150MA SOD123)
IC1  MOCD223R2M  [SOIC127P600-8N]  (parts A,B of 2)
R74  3K  [R 0603(1608)]
R75  3K  [R 0603(1608)]
R76  1.2K  [R 0603(1608)]
R77  4.7K  [R 0603(1608)]
R78  3K  [R 0603(1608)]
R79  3K  [R 0603(1608)]
R80  100K  [R 0603(1608)]
R82  3K  [R 0603(1608)]
R83  3K  [R 0603(1608)]
R84  4.7K  [R 0603(1608)]
R85  1.2K  [R 0603(1608)]
R87  100K  [R 0603(1608)]
R88  3K  [R 0603(1608)]
R89  3K  [R 0603(1608)]

### Ports
DISCRETE_INA (in), DISCRETE_INB (in), MCU_INA (out), MCU_INB (out)

### Nets
+3V3: IC1.6 IC1.8
PGND: R78.1 R80.1 R87.1 R88.1
DISCRETE_INA: R74.1 ; port DISCRETE_INA
DISCRETE_INB: R82.1 ; port DISCRETE_INB
MCU_INA: R77.2 R80.2 ; port MCU_INA
MCU_INB: R84.2 R87.2 ; port MCU_INB
NetC59_1: C59.1 D27.1(A) IC1.2 R76.1 R79.2
NetC59_2: C59.2 D27.2(K) IC1.1 R75.2 R76.2
NetC60_1: C60.1 D28.1(A) IC1.4 R85.1 R89.2
NetC60_2: C60.2 D28.2(K) IC1.3 R83.2 R85.2
NetIC1_5: IC1.5 R84.1
NetIC1_7: IC1.7 R77.1
NetR74_2: R74.2 R75.1
NetR78_2: R78.2 R79.1
NetR82_2: R82.2 R83.1
NetR88_2: R88.2 R89.1

### Notes on the sheet
- DISCRETE INPUT

### Library data of the parts
C59 C60 = CAP CER 1NF 10% 2KV X7R SMD 1206: Cap Ceramic 0.001uF 50V X7R 10% SMD 0603 125C Paper T/R; Manufacturer: Murata; Manufacturer Part Number: GCM188R71H102KA37D; Supplier 1: Digi-Key; Supplier Part Number 1: 490-4777-1-ND; RoHS: Yes; Category: Ceramic Capacitors; Stock 1: 11039468; Pricing 1: 1=0,10000, 10=0,07100, 50=0,03900, 100=0,03180, 500=0,02272, 1000=0,01785 (USD); Mount: Surface Mount; Case/Package: 0603; Case Code (Imperial): 0603; Case Code (Metric): 1608; Min Operating Temperature: -55°C; Max Operating Temperature: 125°C; Capacitance: 1nF; Tolerance: 10%; Dielectric: X7R; Packaging: Tape and Reel; Voltage Rating: 50V; Voltage Rating (DC): 50V; Package Quantity: 4000; Termination: SMD/SMT; Voltage: 50V; Series: GCM; Construction: Flat; Length: 1.6mm; Width: 0.8mm; Height: 0.8mm; Thickness: 0.035inch; Depth: 0.8mm; Ratings: AEC-Q200; Radiation Hardening: No; REACH SVHC: No SVHC; Lead Free: Lead Free; RoHS Compliant: Yes; ComponentLink1URL: https://datasheet.ciiva.com/18183/getdatasheetpartid-310250-18183617.pdf?src-supplier=Verical; ComponentLink1Description: https://datasheet.ciiva.com/18183/getdatasheetpartid-310250-18183617.pdf?src-supplier=Verical; ComponentLink2URL: https://datasheet.ciiva.com/11787/0900766b80ef92d0-11787654.pdf?src-supplier=RSComponents; ComponentLink2Description: https://datasheet.ciiva.com/11787/0900766b80ef92d0-11787654.pdf?src-supplier=RSComponents; ComponentLink3URL: https://datasheet.ciiva.com/131/product-131993.pdf?src-supplier=Digi-Key; ComponentLink3Description: https://datasheet.ciiva.com/131/product-131993.pdf?src-supplier=Digi-Key; ComponentLink4URL: https://datasheet.ciiva.com/131/product-131994.pdf?src-supplier=Digi-Key; ComponentLink4Description: https://datasheet.ciiva.com/131/product-131994.pdf?src-supplier=Digi-Key; ComponentLink5URL: https://datasheet.ciiva.com/131/product-131995.pdf?src-supplier=Digi-Key; ComponentLink5Description: https://datasheet.ciiva.com/131/product-131995.pdf?src-supplier=Digi-Key; ComponentLink6URL: https://datasheet.ciiva.com/11621/product-11621654.pdf?src-supplier=Avnet; ComponentLink6Description: https://datasheet.ciiva.com/11621/product-11621654.pdf?src-supplier=Avnet; ComponentLink7URL: https://datasheet.ciiva.com/16624/product-16624559.pdf?src-supplier=Avnet+Europe; ComponentLink7Description: https://datasheet.ciiva.com/16624/product-16624559.pdf?src-supplier=Avnet+Europe
D27 D28 = DIODE 1N4148 GEN PURP 100V 150MA SOD123: Manufacturer: MICRO COMMERCIAL; Manufacturer Part Name: 1N4148W-TP; Code: 3040007; Family: DIODE; Package Reference: SOD123; Supplier: Digikey; Supplier No: 1N4148WTPMSTR-ND
IC1 = MOCD223R2M: IC OPTOISO DARLINGTON OUTPUT MOCD223R2M 2CH VCE 30V SOIC8; Manufacturer: FAIRCHILD; Code: 3000115; Family: IC; Manufacturer Part Name: MOCD223R2M; Supplier: Mouser; Supplier No: 512-MOCD223R2M; Package Reference: SOIC8; Value: MOCD223R2M
R74 R75 R78 R79 R82 R83 R88 R89 = RES CHIP 3K 1% 1/4W SMD 1206: RES SMD 3K OHM 1% 1/10W 0603; Manufacturer: Yageo; Manufacturer Part Number: RC0603FR-073KL; Resistance: 3kR; Power Rating: 100mW; Voltage Rating: 50V; Temperature Coefficient: 100ppm/°C; Supplier 1: Digi-Key; Supplier Part Number 1: 311-3.00KHRCT-ND; RoHS: Yes; Category: Chip SMD Resistors; Stock 1: 553763; Pricing 1: 1=0,10000, 10=0,02400, 100=0,00970, 1000=0,00436, 2500=0,00378 (USD); Case/Package: 0603; Number of Pins: 2; Case Code (Imperial): 0603; Case Code (Metric): 1608; Size Code: 0603; Min Operating Temperature: -55°C; Max Operating Temperature: 155°C; Tolerance: 1%; Packaging: Tape and Reel; Termination: SMD/SMT; Resistor Type: Thick Film; Voltage Rating (DC): 50V; Features: Moisture Resistant; Series: RC; Max Power Dissipation: 100mW; Number of Terminations: 2; Construction: Rectangular; Resistance Tolerance: 1%; Length: 1.6mm; Width: 800um; Depth: 0.8mm; REACH SVHC: No SVHC; Military Standard: Not; Lead Free: Lead Free; RoHS Compliant: Yes; ComponentLink1URL: http://components.arrow.com/part/dataview/0323_00200942?src-supplier=Arrow+Europe; ComponentLink1Description: http://components.arrow.com/part/dataview/0323_00200942?src-supplier=Arrow+Europe; ComponentLink2URL: http://www.mouser.com/ds/2/447/RC0603-272842.pdf?src-supplier=Mouser; ComponentLink2Description: http://www.mouser.com/ds/2/447/RC0603-272842.pdf?src-supplier=Mouser; ComponentLink3URL: http://www.farnell.com/datasheets/2167052.pdf?src-supplier=Farnell; ComponentLink3Description: http://www.farnell.com/datasheets/2167052.pdf?src-supplier=Farnell; ComponentLink4URL: https://www.verical.com/server-webapp/html/getDatasheet?partID=135099&src-supplier=Verical; ComponentLink4Description: https://www.verical.com/server-webapp/html/getDatasheet?partID=135099&src-supplier=Verical; ComponentLink5URL: http://www.farnell.com/datasheets/2167052.pdf?src-supplier=Element14; ComponentLink5Description: http://www.farnell.com/datasheets/2167052.pdf?src-supplier=Element14; ComponentLink6URL: http://www.farnell.com/datasheets/1868787.pdf?src-supplier=Newark; ComponentLink6Description: http://www.farnell.com/datasheets/1868787.pdf?src-supplier=Newark; ComponentLink7URL: http://www.yageo.com/documents/recent/PYu-RC0603_51_RoHS_L_7.pdf?src-supplier=Future+Electronics; ComponentLink7Description: http://www.yageo.com/documents/recent/PYu-RC0603_51_RoHS_L_7.pdf?src-supplier=Future+Electronics; ComponentLink8URL: http://www.yageo.com/documents/recent/PYu-RC_Group_51_RoHS_L_9.pdf?src-supplier=Digi-Key; ComponentLink8Description: http://www.yageo.com/documents/recent/PYu-RC_Group_51_RoHS_L_9.pdf?src-supplier=Digi-Key; ComponentLink9URL: http://www.yageo.com/documents/recent/PYu-RC_Group_51_RoHS_L_10.pdf?src-supplier=Digi-Key; ComponentLink9Description: http://www.yageo.com/documents/recent/PYu-RC_Group_51_RoHS_L_10.pdf?src-supplier=Digi-Key
R76 R85 = RES CHIP 1K2 5% 1/4W SMD 1206: RES SMD 1.2K OHM 1% 1/10W 0603; Manufacturer: Vishay; Manufacturer Part Number: CRCW06031K20FKEA; Resistance: 1.2kR; Power Rating: 100mW; Voltage Rating: 75V; Temperature Coefficient: 100ppm/°C; Supplier 1: Digi-Key; Supplier Part Number 1: 541-1.20KHCT-ND; RoHS: Yes; Category: Chip SMD Resistors; Stock 1: 4565; Pricing 1: 1=0,10000, 10=0,03800, 100=0,01560, 1000=0,00701, 2500=0,00608 (USD); Mount: Surface Mount; Case/Package: 0603; Weight: 7.1E-05oz; Case Code (Metric): 1608; Case Code (Imperial): 0603; Contact Plating: Tin; Size Code: 0603; Min Operating Temperature: -55°C; Max Operating Temperature: 155°C; Tolerance: 1%; Package Quantity: 10; Packaging: Tape and Reel; Resistor Type: Thick Film; Number of Terminations: 2; Termination: SMD/SMT; Max Power Dissipation: 100mW; Voltage Rating (DC): 75V; Features: Automotive AEC-Q200; Series: CRCW; Technology: THICK FILM; Construction: Rectangular; Resistance Tolerance: 1%; Length: 1.55mm; Width: 0.033inch; Height: 0.45mm; Depth: 0.85mm; Radiation Hardening: No; Lead Free: Lead Free; RoHS Compliant: Yes; REACH SVHC: Unknown; Military Standard: Not; ComponentLink1URL: https://datasheet.ciiva.com/11811/0900766b80d98afc-11811521.pdf?src-supplier=RSComponents; ComponentLink1Description: https://datasheet.ciiva.com/11811/0900766b80d98afc-11811521.pdf?src-supplier=RSComponents; ComponentLink2URL: https://datasheet.ciiva.com/2466/dcrcwe3-2466208.pdf?src-supplier=Digi-Key; ComponentLink2Description: https://datasheet.ciiva.com/2466/dcrcwe3-2466208.pdf?src-supplier=Digi-Key; ComponentLink3URL: https://datasheet.ciiva.com/16778/70201119-16778936.pdf?src-supplier=Allied+Electronics; ComponentLink3Description: https://datasheet.ciiva.com/16778/70201119-16778936.pdf?src-supplier=Allied+Electronics; ComponentLink4URL: https://datasheet.ciiva.com/22871/70201119-22871945.pdf?src-supplier=Allied+Electronics; ComponentLink4Description: https://datasheet.ciiva.com/22871/70201119-22871945.pdf?src-supplier=Allied+Electronics; ComponentLink5URL: https://datasheet.ciiva.com/26316/fld-crcw-e3-data-en-26316553.pdf?src-supplier=Distrelec; ComponentLink5Description: https://datasheet.ciiva.com/26316/fld-crcw-e3-data-en-26316553.pdf?src-supplier=Distrelec; ComponentLink6URL: https://datasheet.ciiva.com/7777/1697337-7777291.pdf?src-supplier=Element14; ComponentLink6Description: https://datasheet.ciiva.com/7777/1697337-7777291.pdf?src-supplier=Element14; ComponentLink7URL: https://datasheet.ciiva.com/5562/dcrcwe3-109170-5562444.pdf?src-supplier=Mouser; ComponentLink7Description: https://datasheet.ciiva.com/5562/dcrcwe3-109170-5562444.pdf?src-supplier=Mouser; ComponentLink8URL: https://datasheet.ciiva.com/7777/1697337-7777549.pdf?src-supplier=Element14; ComponentLink8Description: https://datasheet.ciiva.com/7777/1697337-7777549.pdf?src-supplier=Element14; ComponentLink9URL: https://datasheet.ciiva.com/2466/dcrcwe3-2466206.pdf?src-supplier=Digi-Key; ComponentLink9Description: https://datasheet.ciiva.com/2466/dcrcwe3-2466206.pdf?src-supplier=Digi-Key; ComponentLink10URL: https://datasheet.ciiva.com/2466/dcrcwe3-2466207.pdf?src-supplier=Digi-Key; ComponentLink10Description: https://datasheet.ciiva.com/2466/dcrcwe3-2466207.pdf?src-supplier=Digi-Key
R77 R84 = RES CHIP 4K7 5% 1/16W SMD 0402: RES SMD 4.7K OHM 1% 1/10W 0603; Manufacturer: Yageo; Manufacturer Part Number: RC0603FR-074K7L; Resistance: 4.7kR; Temperature Coefficient: 100ppm/°C; Power Rating: 100mW; Voltage Rating (DC): 50V; Supplier 1: Digi-Key; Supplier Part Number 1: 311-4.70KHRCT-ND; RoHS: Yes; Category: Chip SMD Resistors; Stock 1: 3053433; Pricing 1: 1=0,10000, 10=0,02400, 100=0,00970, 1000=0,00436, 2500=0,00378 (USD); Case/Package: 0603; Number of Pins: 2; Case Code (Imperial): 0603; Case Code (Metric): 1608; Size Code: 0603; Min Operating Temperature: -55°C; Max Operating Temperature: 155°C; Tolerance: 1%; Resistor Type: Thick Film; Packaging: Tape and Reel; Voltage Rating: 50V; Termination: SMD/SMT; Features: Moisture Resistant; Series: RC; Max Power Dissipation: 100mW; Number of Terminations: 2; Construction: Rectangular; Resistance Tolerance: 1%; Length: 1.6mm; Width: 0.8mm; Height: 0.45mm; Depth: 0.8mm; Lead Pitch: 0.3mm; REACH SVHC: No SVHC; Lead Free: Lead Free; RoHS Compliant: Yes; Military Standard: Not; ComponentLink1URL: https://datasheet.ciiva.com/15189/getdatasheetpartid-422754-15189760.pdf?src-supplier=Verical; ComponentLink1Description: https://datasheet.ciiva.com/15189/getdatasheetpartid-422754-15189760.pdf?src-supplier=Verical; ComponentLink2URL: https://datasheet.ciiva.com/22747/443971-22747528.pdf?src-supplier=Element14; ComponentLink2Description: https://datasheet.ciiva.com/22747/443971-22747528.pdf?src-supplier=Element14; ComponentLink3URL: https://datasheet.ciiva.com/7660/38590-7660794.pdf?src-supplier=Element14; ComponentLink3Description: https://datasheet.ciiva.com/7660/38590-7660794.pdf?src-supplier=Element14; ComponentLink4URL: https://datasheet.ciiva.com/7746/1868787-7746365.pdf?src-supplier=Element14; ComponentLink4Description: https://datasheet.ciiva.com/7746/1868787-7746365.pdf?src-supplier=Element14; ComponentLink5URL: https://datasheet.ciiva.com/46440/1868787-46440909.pdf?src-supplier=Element14; ComponentLink5Description: https://datasheet.ciiva.com/46440/1868787-46440909.pdf?src-supplier=Element14; ComponentLink6URL: https://datasheet.ciiva.com/7746/1738695-7746366.pdf?src-supplier=Element14; ComponentLink6Description: https://datasheet.ciiva.com/7746/1738695-7746366.pdf?src-supplier=Element14
R80 R87 = RES CHIP 100K 1% 1/16W SMD 0402: Res Thick Film 1.6 x 0.8 mm 100K Ohm 1% 0.1W(1/10W) 100ppm/ C Molded SMD Paper T/R; Manufacturer: Yageo; Manufacturer Part Number: RC0603FR-07100KL; Resistance: 100kR; Temperature Coefficient: 100ppm/°C; Voltage Rating (DC): 50V; Power Rating: 100mW; Working Voltage: 75V; Supplier 1: Digi-Key; Supplier Part Number 1: 311-100KHRCT-ND; RoHS: Yes; Category: Chip SMD Resistors; Stock 1: 10063121; Pricing 1: 1=0,10000, 10=0,02400, 100=0,00970, 1000=0,00436, 2500=0,00378 (USD); Case/Package: 0603; Number of Pins: 2; Case Code (Imperial): 0603; Case Code (Metric): 1608; Min Operating Temperature: -55°C; Max Operating Temperature: 155°C; Tolerance: 1%; Resistor Type: Thick Film; Packaging: Tape and Reel; Voltage Rating: 50V; Termination: SMD/SMT; Number of Terminations: 2; Features: Moisture Resistant; Series: RC; Max Power Dissipation: 100mW; Resistance Tolerance: 1%; Construction: Rectangular; Technology: THICK FILM; Length: 1.6mm; Width: 0.8mm; Height: 0.45mm; Depth: 0.8mm; REACH SVHC: No SVHC; Lead Free: Lead Free; Military Standard: Not; RoHS Compliant: Yes

## Sheet ANALOG_MUX.SchDoc
size A4; SheetNumber: 4; SheetTotal: 13
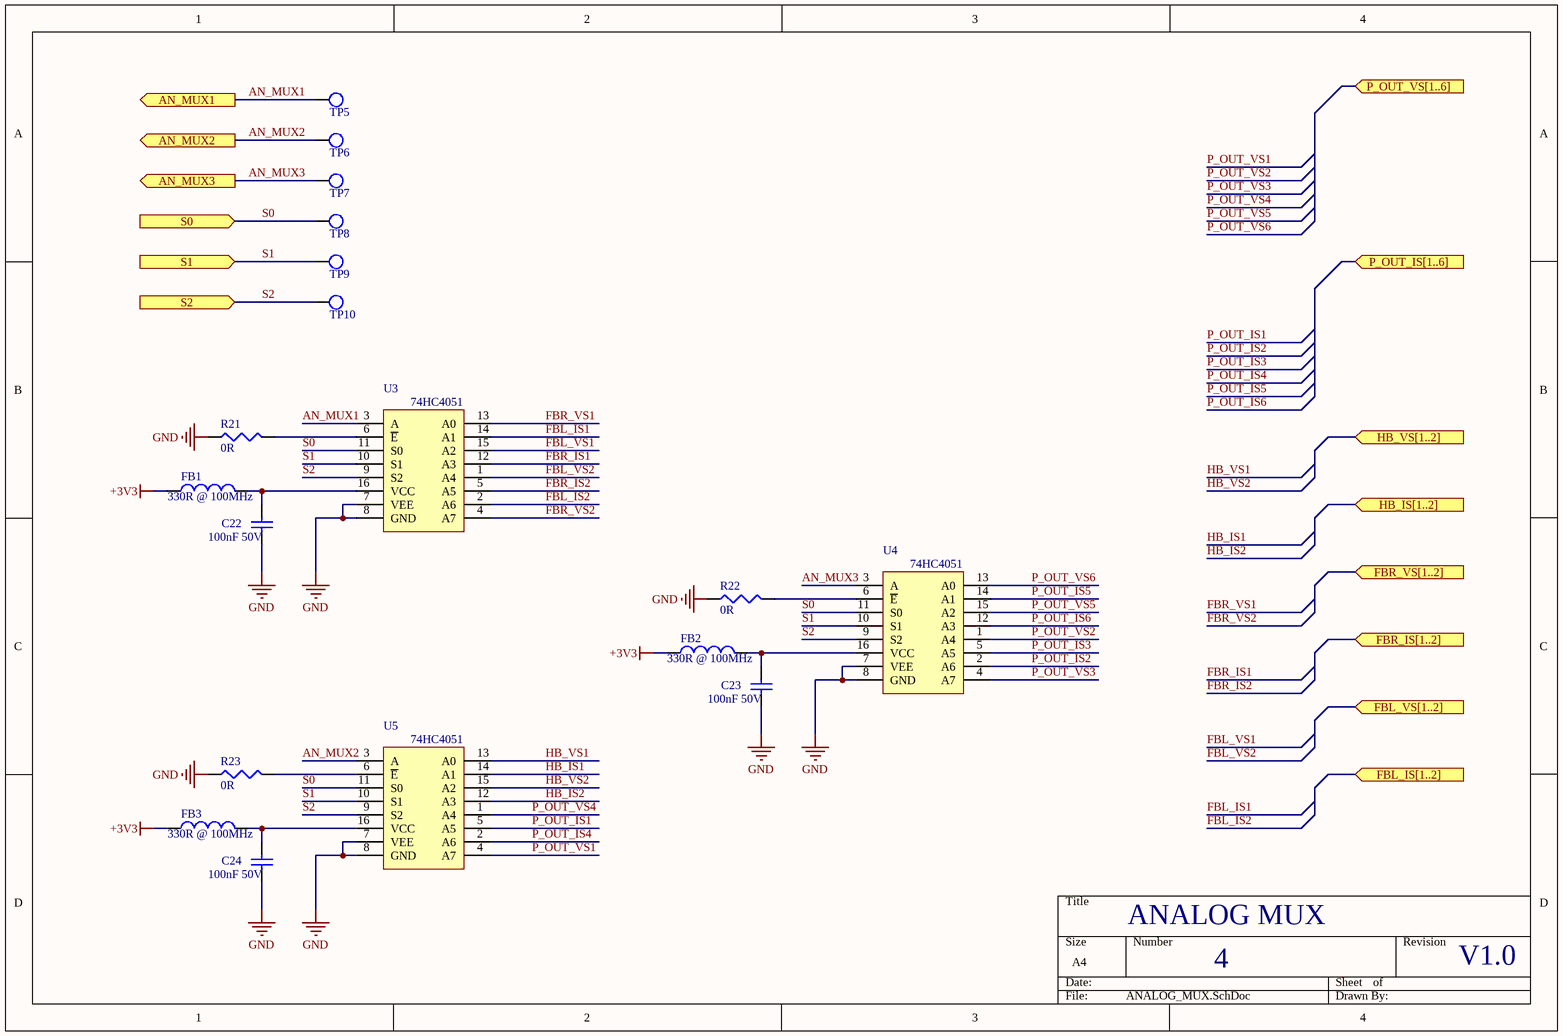
[diagram p15: ANALOG_MUX.SchDoc]

### Parts
C22  100nF 50V  [CAP0603]
C23  100nF 50V  [CAP0603]
C24  100nF 50V  [CAP0603]
FB1  330R @ 100MHz  [FB0603]
FB2  330R @ 100MHz  [FB0603]
FB3  330R @ 100MHz  [FB0603]
R21  0R  [RES0603]
R22  0R  [RES0603]
R23  0R  [RES0603]
TP5  TEST_POINT  [TEST_POINT_TH]  (value not drawn)  (no BOM)
TP6  TEST_POINT  [TEST_POINT_TH]  (value not drawn)  (no BOM)
TP7  TEST_POINT  [TEST_POINT_TH]  (value not drawn)  (no BOM)
TP8  TEST_POINT  [TEST_POINT_TH]  (value not drawn)  (no BOM)
TP9  TEST_POINT  [TEST_POINT_TH]  (value not drawn)  (no BOM)
TP10  TEST_POINT  [TEST_POINT_TH]  (value not drawn)  (no BOM)
U3  74HC4051  [TSSOP16]
U4  74HC4051  [TSSOP16]
U5  74HC4051  [TSSOP16]

### Ports
AN_MUX1 (out), AN_MUX2 (out), AN_MUX3 (out), FBL_IS[1..2] (in), FBL_VS[1..2] (in), FBR_IS[1..2] (in), FBR_VS[1..2] (in), HB_IS[1..2] (in), HB_VS[1..2] (in), P_OUT_IS[1..6] (in), P_OUT_VS[1..6] (in), S0 (in), S1 (in), S2 (in)

### Nets
+3V3: FB1.1 FB2.1 FB3.1
GND: C22.1 C23.1 C24.1 R21.1 R22.1 R23.1 U3.7(VEE) U3.8(GND) U4.7(VEE) U4.8(GND) U5.7(VEE) U5.8(GND)
AN_MUX1: TP5.1 U3.3(A) ; port AN_MUX1
AN_MUX2: TP6.1 U5.3(A) ; port AN_MUX2
AN_MUX3: TP7.1 U4.3(A) ; port AN_MUX3
FBL_IS1: U3.14(A1)
FBL_IS2: U3.2(A6)
FBL_VS1: U3.15(A2)
FBL_VS2: U3.1(A4)
FBR_IS1: U3.12(A3)
FBR_IS2: U3.5(A5)
FBR_VS1: U3.13(A0)
FBR_VS2: U3.4(A7)
HB_IS1: U5.14(A1)
HB_IS2: U5.12(A3)
HB_VS1: U5.13(A0)
HB_VS2: U5.15(A2)
P_OUT_IS1: U5.5(A5)
P_OUT_IS2: U4.2(A6)
P_OUT_IS3: U4.5(A5)
P_OUT_IS4: U5.2(A6)
P_OUT_IS5: U4.14(A1)
P_OUT_IS6: U4.12(A3)
P_OUT_VS1: U5.4(A7)
P_OUT_VS2: U4.1(A4)
P_OUT_VS3: U4.4(A7)
P_OUT_VS4: U5.1(A4)
P_OUT_VS5: U4.15(A2)
P_OUT_VS6: U4.13(A0)
S0: TP8.1 U3.11(S0) U4.11(S0) U5.11(S0) ; port S0
S1: TP9.1 U3.10(S1) U4.10(S1) U5.10(S1) ; port S1
S2: TP10.1 U3.9(S2) U4.9(S2) U5.9(S2) ; port S2
NetC22_2: C22.2 FB1.2 U3.16(VCC)
NetC23_2: C23.2 FB2.2 U4.16(VCC)
NetC24_2: C24.2 FB3.2 U5.16(VCC)
NetR21_2: R21.2 U3.6(~{E})
NetR22_2: R22.2 U4.6(~{E})
NetR23_2: R23.2 U5.6(~{E})

### Notes on the sheet
- ANALOG MUX

### Library data of the parts
C22-C24 = CAP0603_100nF: as C66 on sheet Controller; Value: 100nF 50V
FB1-FB3 = FB0603_330R@100MHz: as FB6 on sheet Controller; Value: 330R @ 100MHz
R21-R23 = RES0603_0R: as R96 on sheet Controller; Value: 0R
U3-U5 = AN_MUX_CD74HC4051: IC MUX/DEMUX 8X1 16TSSOP; P/N: CD74HC4051QPWRQ1; Order Code: DIGI : 296-31590-1-ND; Value: 8:1